# EAGLE schematic Powermatic Bandsaw TinkerAccess (EAGLE 9.7.0)
DRAWING_TITLE: Powermatic Bandsaw TinkerAccess

## Sheet 1 of 3
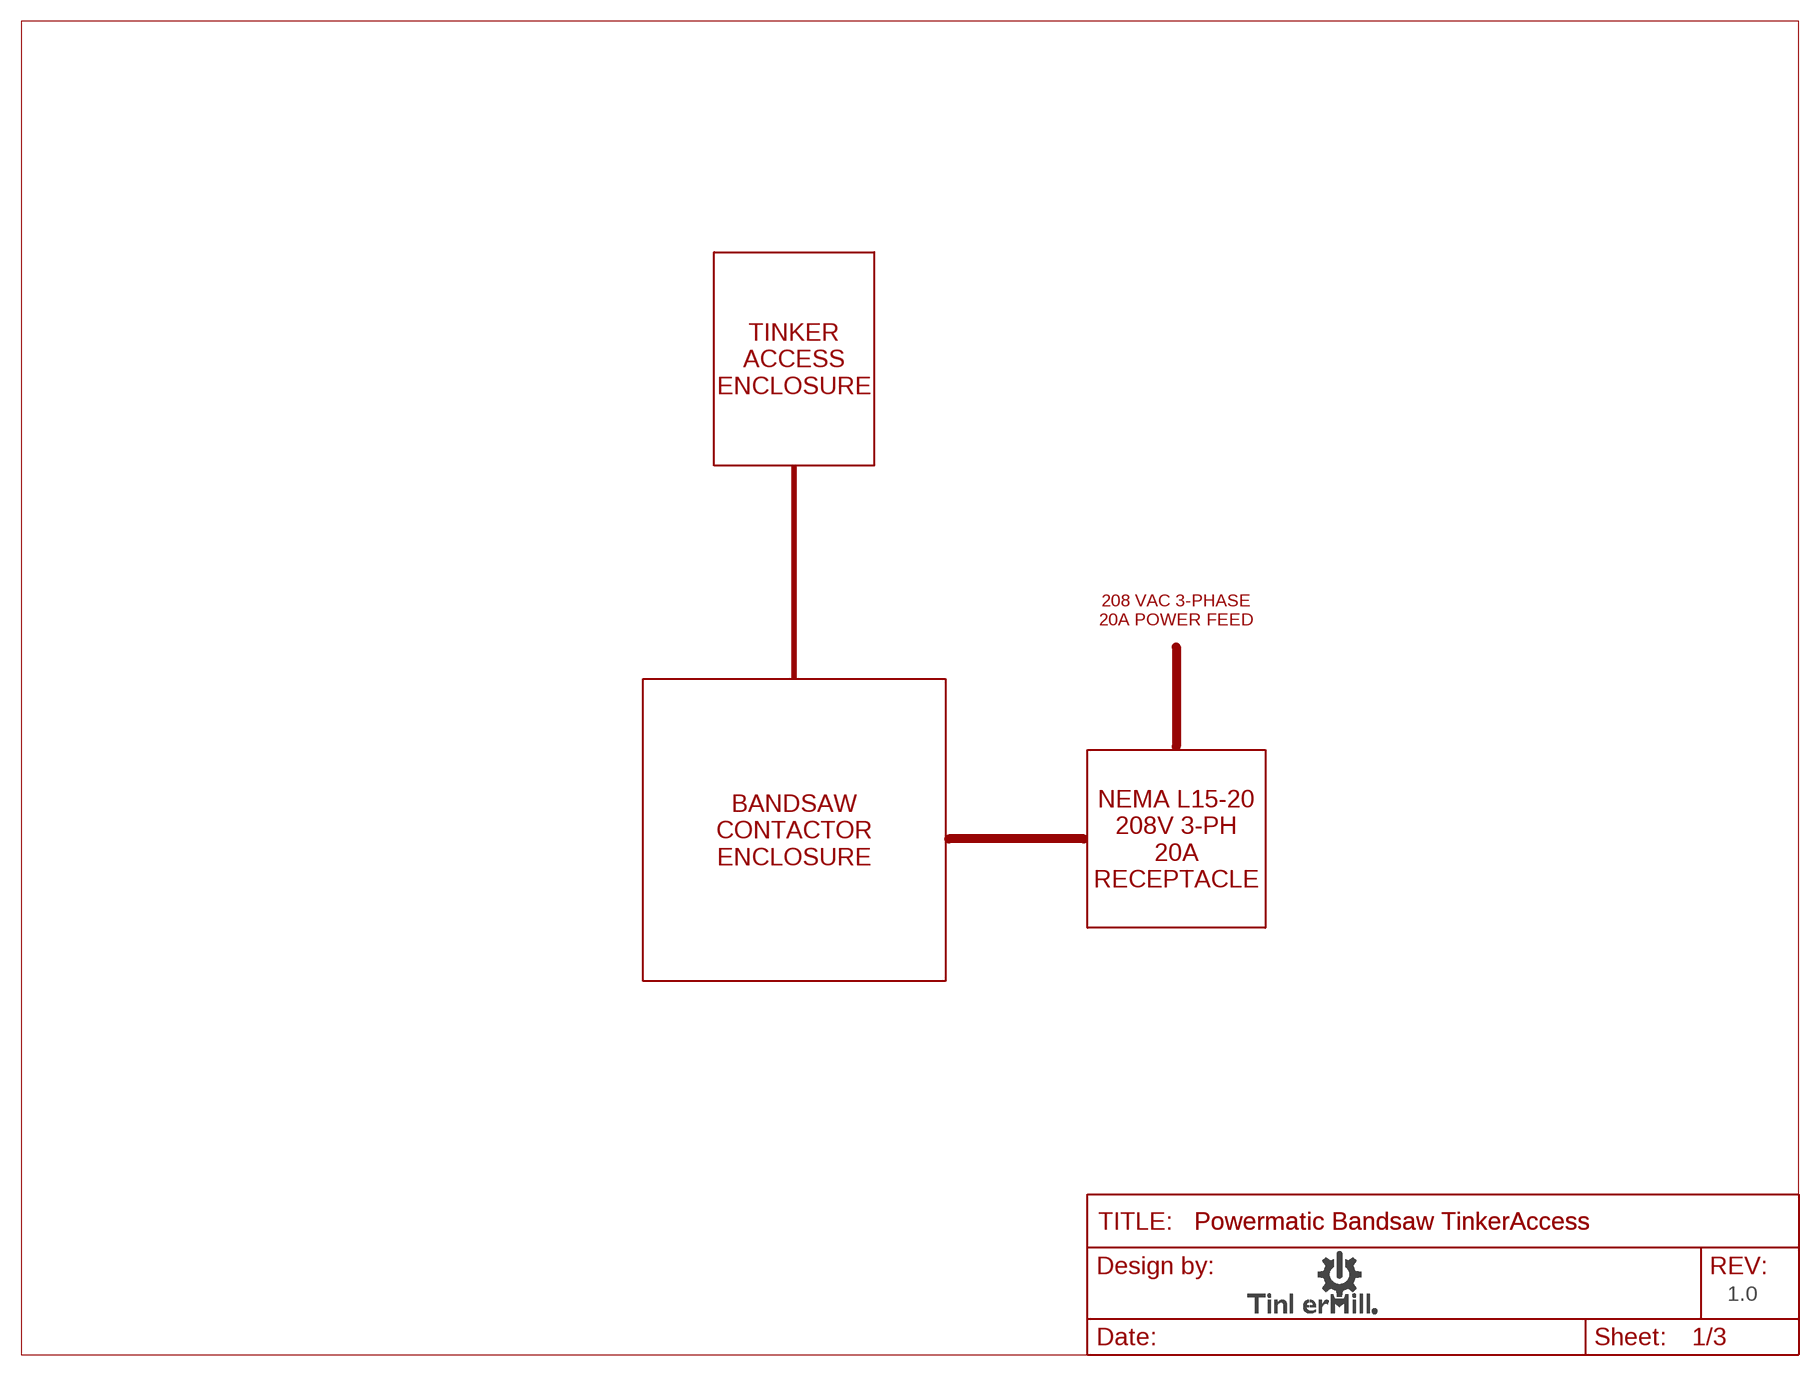
[diagram p0: schematic, sheet 1]

### Notes on the sheet
- TINKER
  ACCESS
  ENCLOSURE
- 208 VAC 3-PHASE
  20A POWER FEED
- BANDSAW
  CONTACTOR
  ENCLOSURE
- NEMA L15-20
  208V 3-PH
  20A
  RECEPTACLE
- 1.0

## Sheet 2 of 3
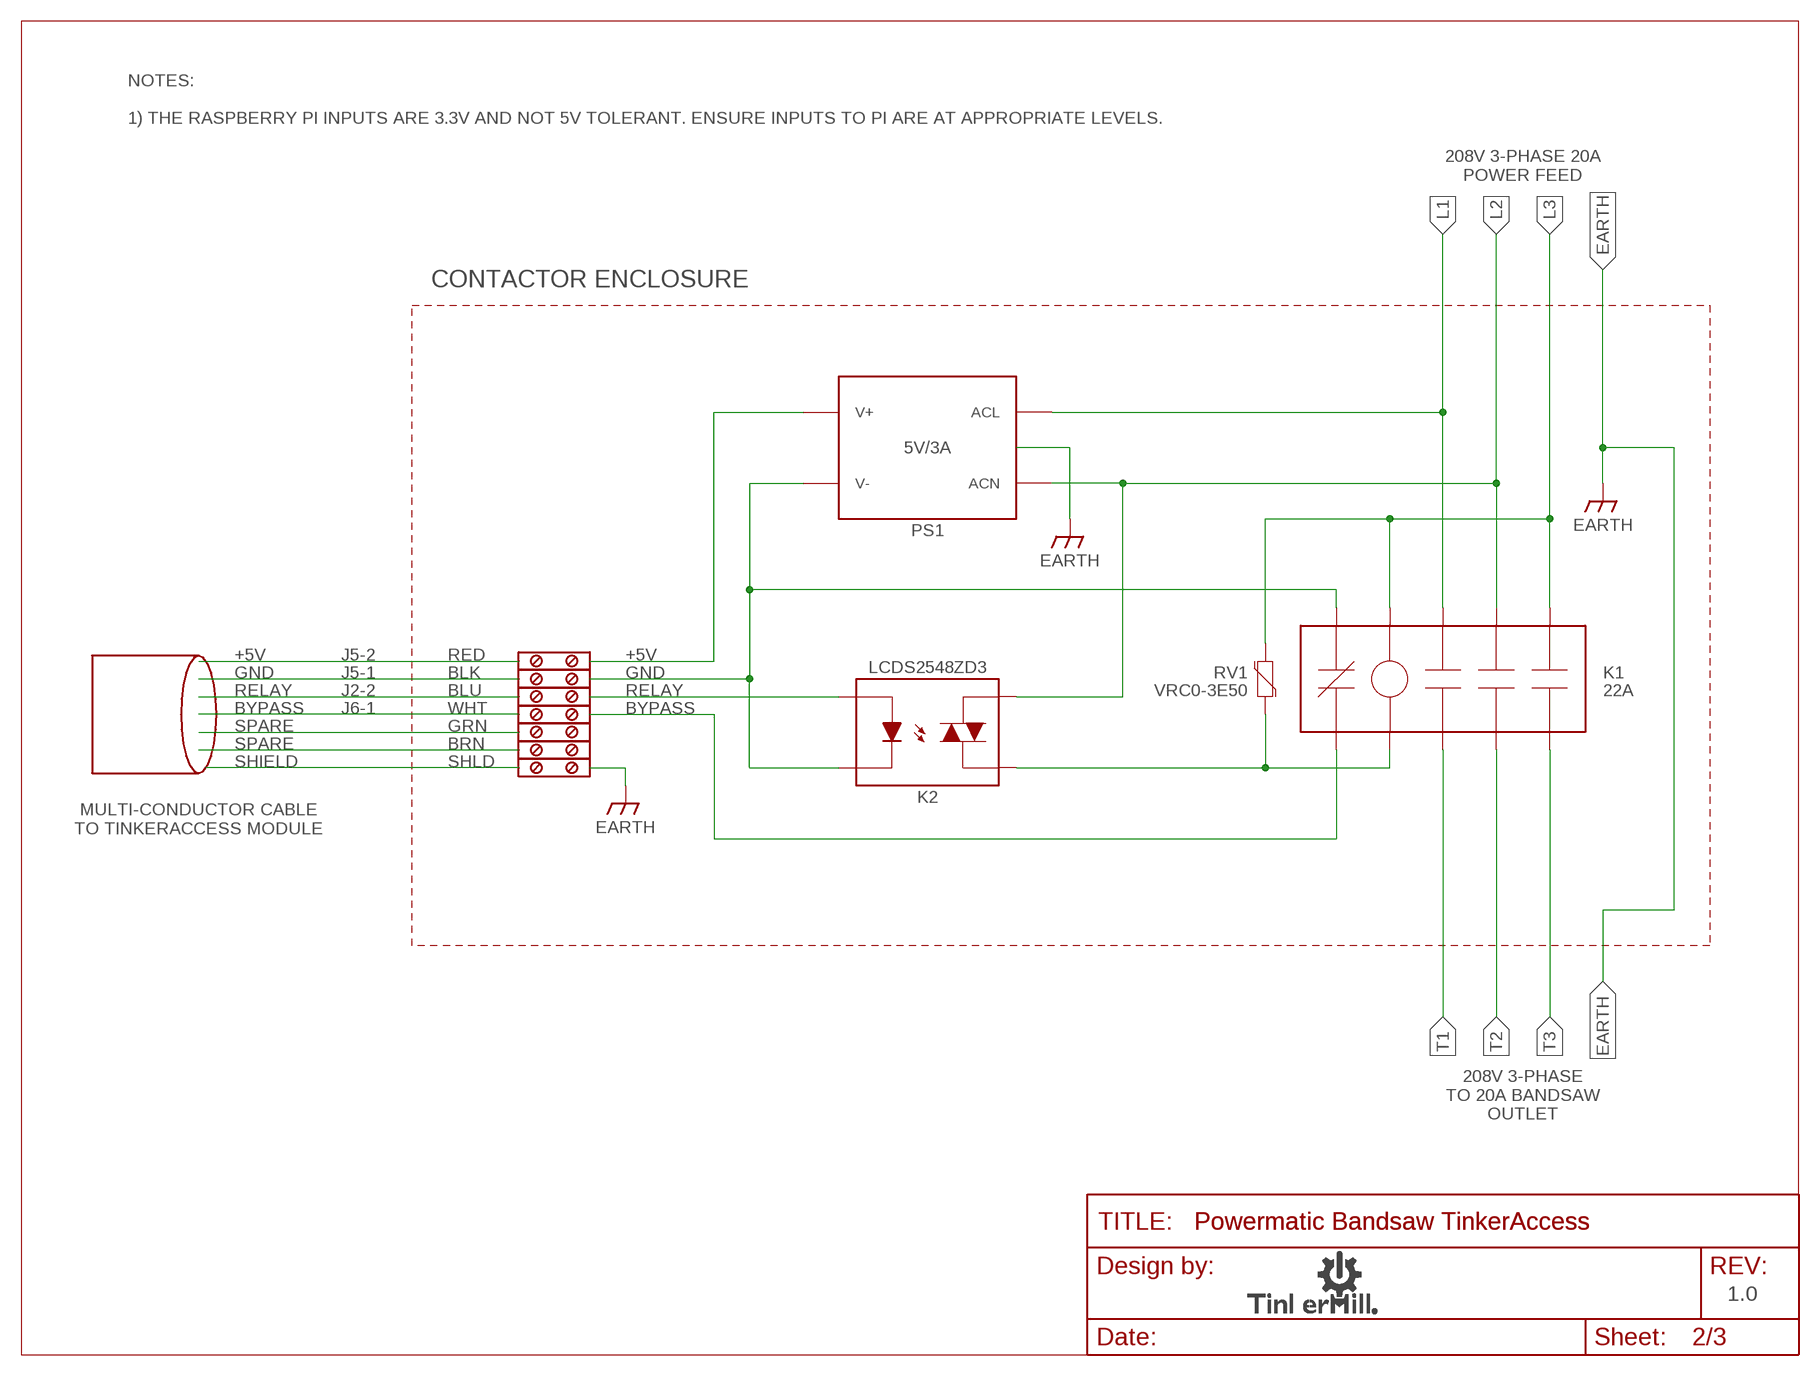
[diagram p1: schematic, sheet 2]

### Parts
K1  22A  CONTACTOR_3POLE_NC_AUX  (no package)
K2  LCDS2548ZD3  SOLID_STATE_RELAY  (no package)
PS1  5V/3A  POWER_SUPPLY  (no package)
RV1  VRC0-3E50  VARISTOR_EPCOS_SK14K320  [EPCOS_14MM_DISC_5.4MM_TH]
TB1  TERMINAL_BLOCK  (no package)
TB2  TERMINAL_BLOCK  (no package)
TB3  TERMINAL_BLOCK  (no package)
TB4  TERMINAL_BLOCK  (no package)
TB5  TERMINAL_BLOCK  (no package)
TB6  TERMINAL_BLOCK  (no package)
TB7  TERMINAL_BLOCK  (no package)

### Nets
+5V: PS1.V+ TB1.B
BLK1: TB2.A ; also sheet 3
BLU1: TB3.A ; also sheet 3
BRN1: TB6.A ; also sheet 3
BYPASS: K1.NC2 TB4.B
C2: K1.A2 K2.L2 RV1.1
EARTH: TB7.B
GND: K1.NC1 K2.A2 PS1.V- TB2.B
GRN1: TB5.A ; also sheet 3
L1: K1.L1 PS1.ACL
L2: K1.L2 K2.L1 PS1.ACN
L3: K1.A1 K1.L3 RV1.2
RED1: TB1.A ; also sheet 3
RELAY: K2.A1 TB3.B
SHLD1: TB7.A
T1: K1.T1
T2: K1.T2
T3: K1.T3
WHT1: TB4.A ; also sheet 3
Unconnected: TB5.B TB6.B

### Notes on the sheet
- NOTES:
  
  1) THE RASPBERRY PI INPUTS ARE 3.3V AND NOT 5V TOLERANT. ENSURE INPUTS TO PI ARE AT APPROPRIATE LEVELS.
- 208V 3-PHASE 20A
  POWER FEED
- CONTACTOR ENCLOSURE
- +5V | J5-2 | RED
- GND | J5-1 | BLK
- RELAY | J2-2 | BLU
- BYPASS | J6-1 | WHT
- SPARE | GRN
- SPARE | BRN
- SHIELD | SHLD
- MULTI-CONDUCTOR CABLE
  TO TINKERACCESS MODULE
- 208V 3-PHASE
  TO 20A BANDSAW
  OUTLET
- 1.0

## Sheet 3 of 3
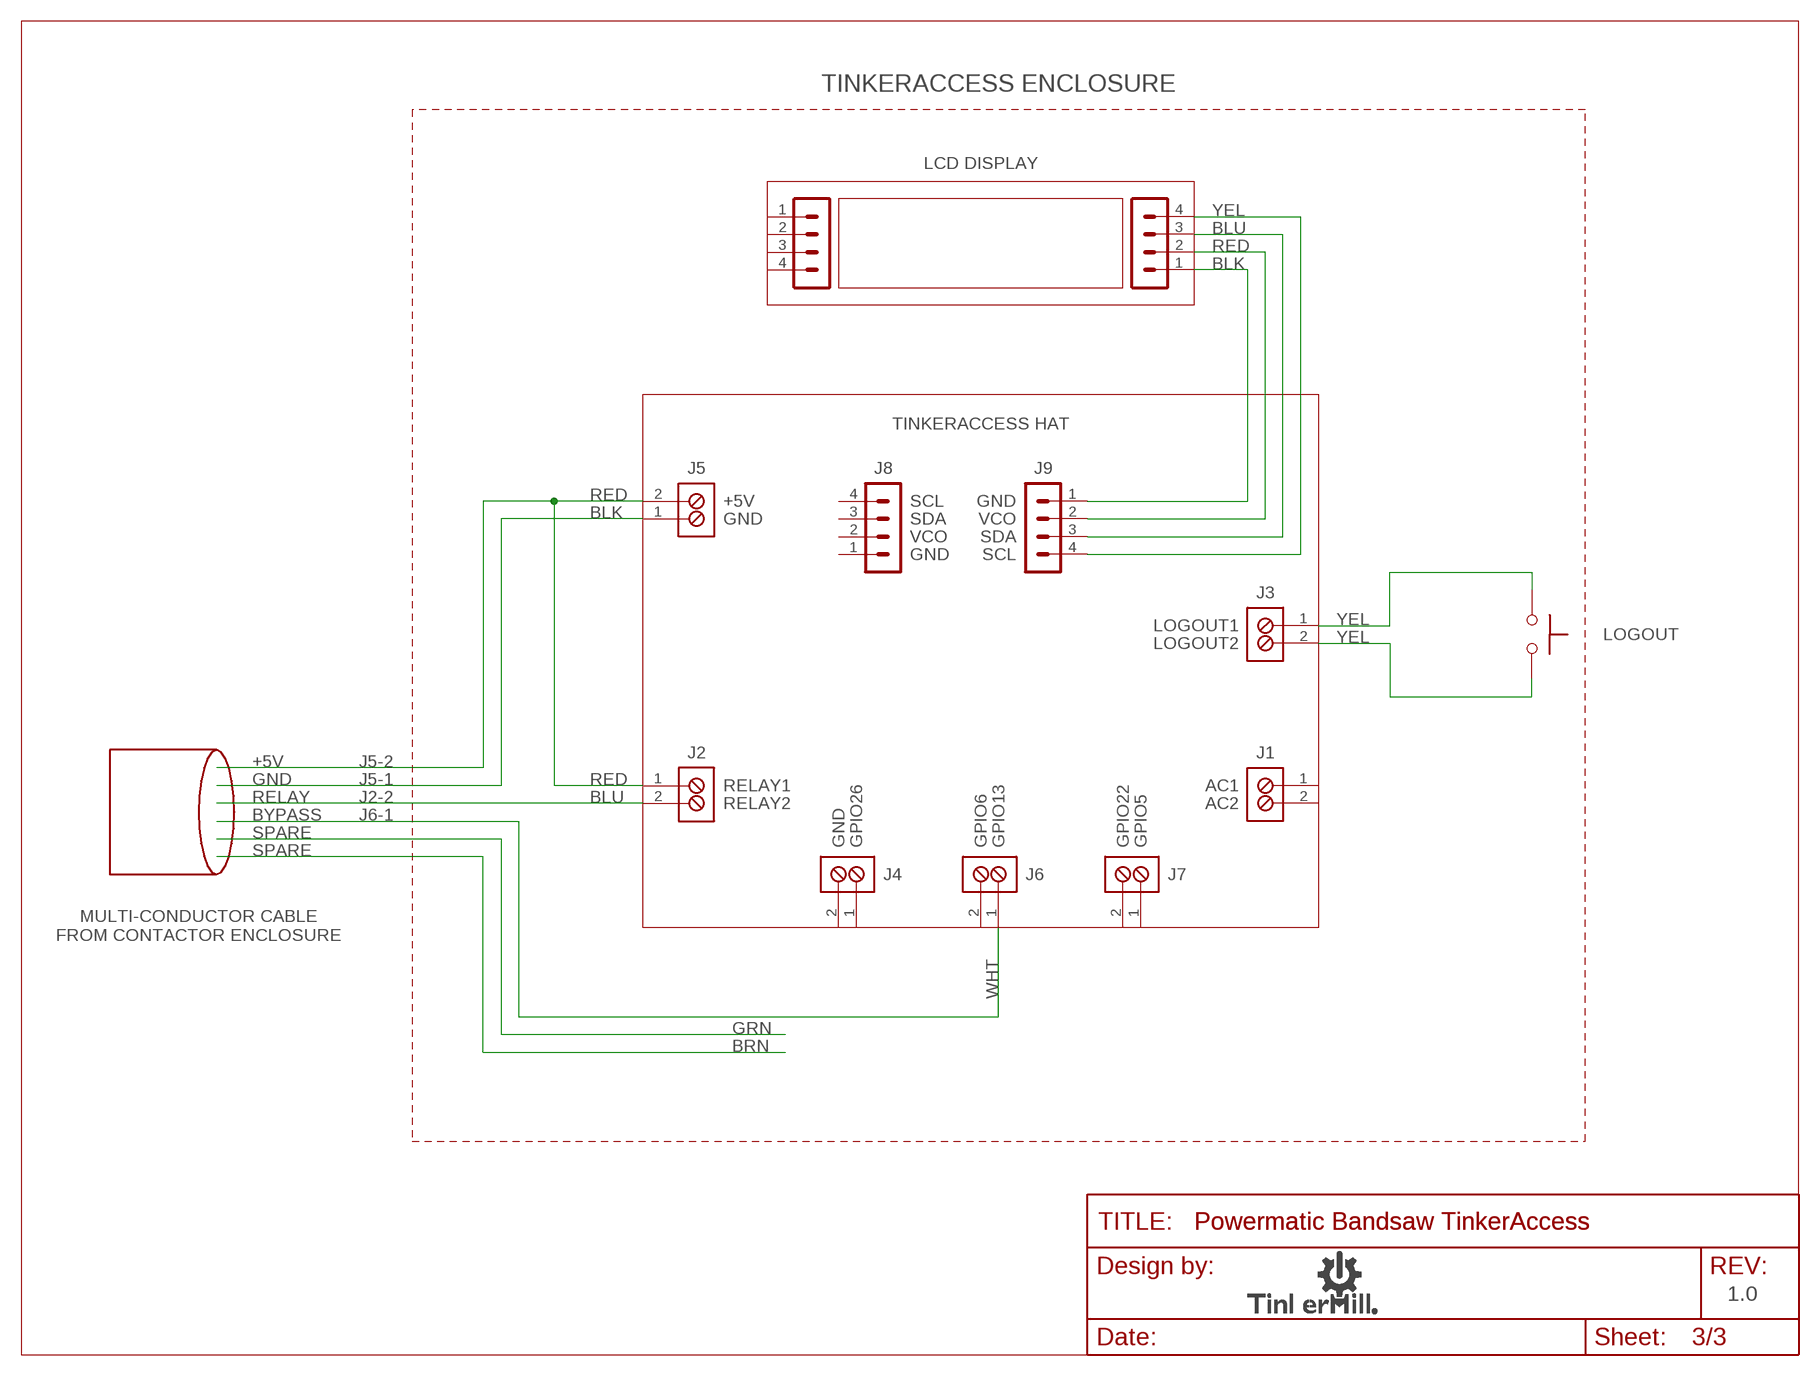
[diagram p2: schematic, sheet 3]

### Parts
J1  TB_2X1_TE_CONN_ED555_2DS  [TE_CONN_ED555_2DS]
J2  TB_2X1_TE_CONN_ED555_2DS  [TE_CONN_ED555_2DS]
J3  TB_2X1_TE_CONN_ED555_2DS  [TE_CONN_ED555_2DS]
J4  TB_2X1_TE_CONN_ED555_2DS  [TE_CONN_ED555_2DS]
J5  TB_2X1_TE_CONN_ED555_2DS  [TE_CONN_ED555_2DS]
J6  TB_2X1_TE_CONN_ED555_2DS  [TE_CONN_ED555_2DS]
J7  TB_2X1_TE_CONN_ED555_2DS  [TE_CONN_ED555_2DS]
J8  HDR_4X1_2.54MM_LOCKING_RA  [HDR_4X1_2.54MM_LOCKING_RA]
J9  HDR_4X1_2.54MM_LOCKING_RA  [HDR_4X1_2.54MM_LOCKING_RA]
J10  HDR_4X1_2.54MM_LOCKING_RA  [HDR_4X1_2.54MM_LOCKING_RA]
J11  HDR_4X1_2.54MM_LOCKING_RA  [HDR_4X1_2.54MM_LOCKING_RA]
SW3  LOGOUT  PUSHBUTTON_MOMENTARY_NO_OMRON_B3F_6MM  [OMRON_B3F_6MM]

### Nets
BLK1: J5.1 ; also sheet 2
BLK2: J9.1 J11.1
BLU1: J2.2 ; also sheet 2
BLU2: J9.3 J11.3
LOGOUT1: J3.1 SW3.1 SW3.2
LOGOUT2: J3.2 SW3.3 SW3.4
RED1: J2.1 J5.2 ; also sheet 2
RED2: J9.2 J11.2
WHT1: J6.1 ; also sheet 2
YEL2: J9.4 J11.4
Unconnected: J1.1 J1.2 J4.1 J4.2 J6.2 J7.1 J7.2 J8.1 J8.2 J8.3 J8.4 J10.1 J10.2 J10.3 J10.4

### Notes on the sheet
- TINKERACCESS ENCLOSURE
- LCD DISPLAY
- YEL
- BLU
- RED
- BLK
- TINKERACCESS HAT
- RED | +5V | SCL | GND
- BLK | GND | SDA | VCO
- VCO | SDA
- GND | SCL
- LOGOUT1 | YEL
- LOGOUT2 | YEL
- +5V | J5-2
- GND | J5-1 | RED | RELAY1 | AC1
- RELAY | J2-2 | BLU | RELAY2 | AC2
- BYPASS | J6-1
- SPARE
- GND | GPIO26 | GPIO6 | GPIO13 | GPIO22 | GPIO5
- SPARE
- MULTI-CONDUCTOR CABLE
  FROM CONTACTOR ENCLOSURE
- WHT
- GRN
- BRN
- 1.0

## Library data of the parts
J1-J7 = TMF_Connectors:TB_2X1
J8-J11 = TMF_Connectors:HDR_4X1
K1 = LTT Schematic Only:CONTACTOR_3POLE_NC_AUX
K2 = TMF_Schematic_Only:SOLID_STATE_RELAY
PS1 = TMF_Schematic_Only:POWER_SUPPLY
RV1 = TMF_Passives:VARISTOR
SW3 = TMF_Switches:PUSHBUTTON_MOMENTARY_NO
TB1-TB7 = LTT Schematic Only:TERMINAL_BLOCK